# Altium schematic sheet MGT_PWR.SchDoc: {Наименование}
size 420 x 297 mm; DocumentNumber: ПЛАС.ХХХХХХ.ХХХ ХХ; SheetNumber: 2; SheetTotal: 11; PageSetup: Record=PageOptions|CenterHorizontal=False|CenterVertical=False|PrintScale=0.95|XCorrection=0.00|YCorrection=0.00|PrintKind=1|BorderSize=5000000|LeftOffset=0|BottomOffset=0|Orientation=1|PaperLength=1000|PaperWidth=1000|Scale=100|PaperSource=15|PrintQuality=600|MediaType=1|DitherType=10|PaperKind=A4|PrintScaleMode=1; Rule: PcbType=ProtelPcb
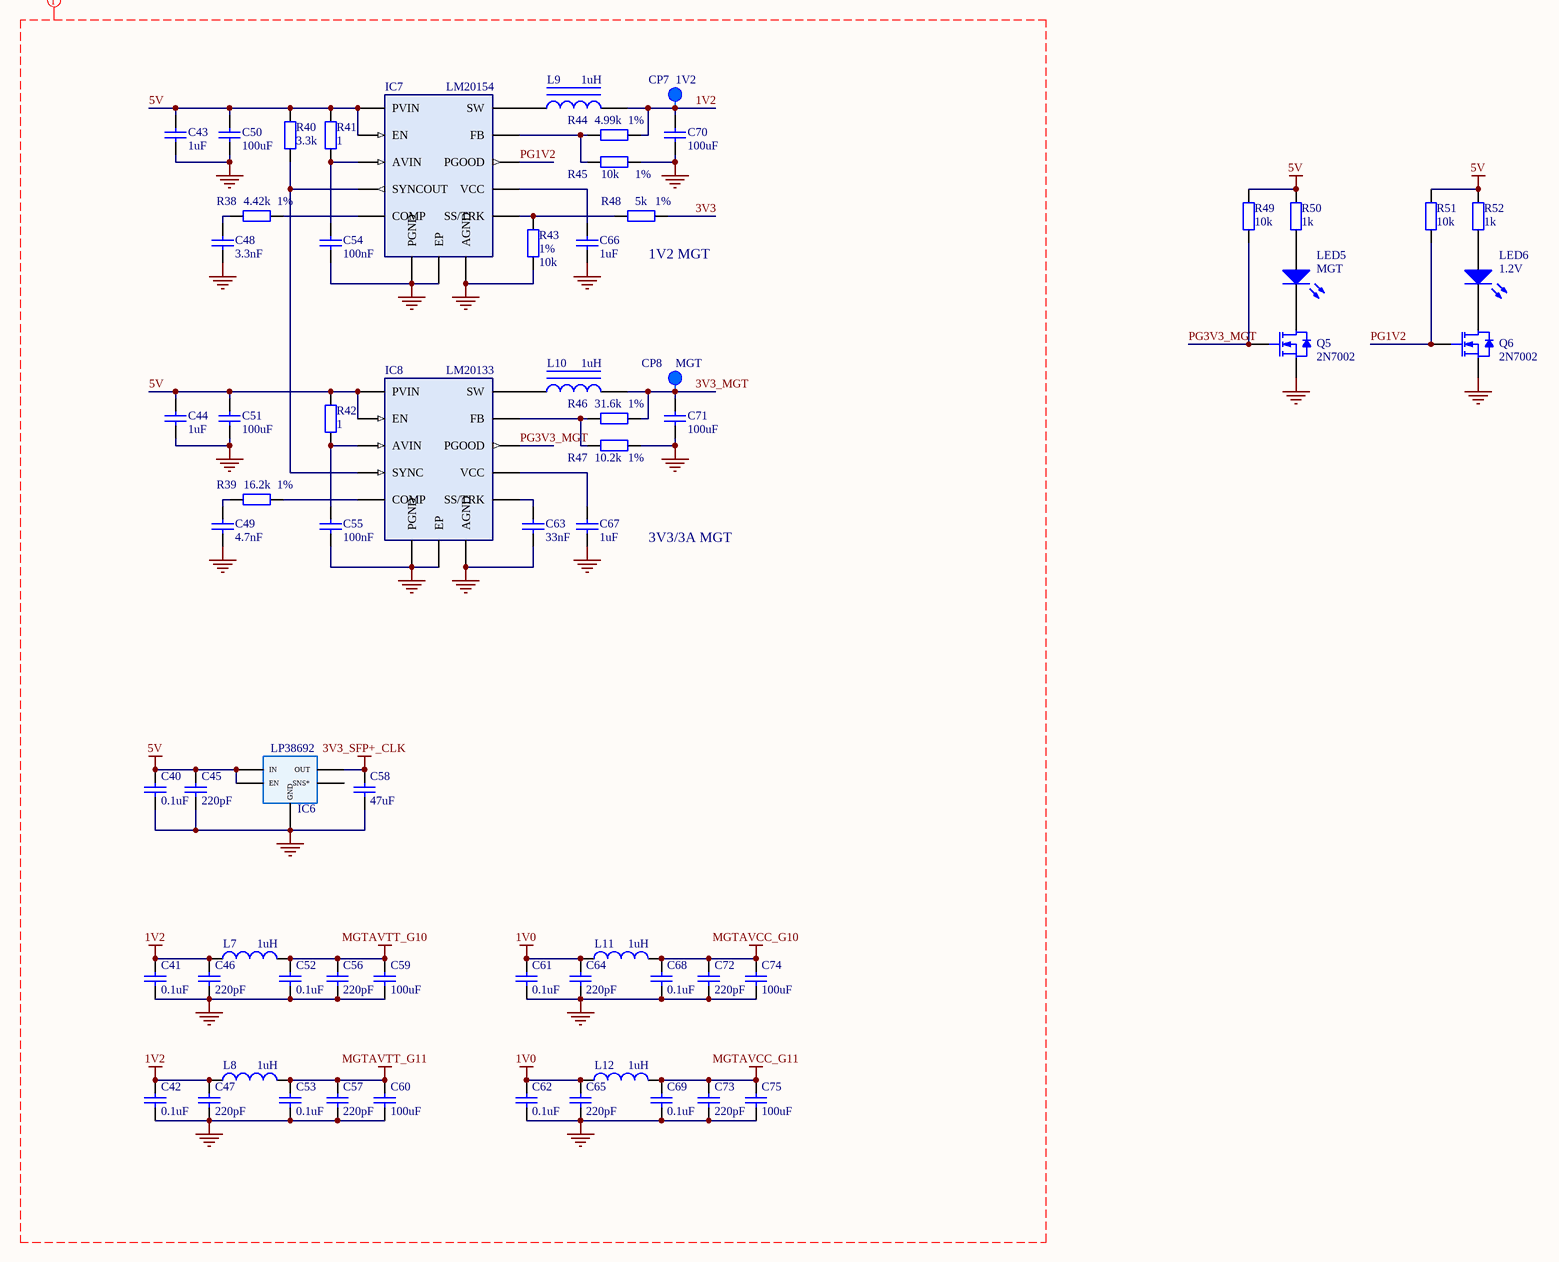
[diagram p0: MGT_PWR.SchDoc]

## Parts
C40  value 0.1uF  [C0603]  (hidden comment: Cap)
C41  value 0.1uF  [C0603]  (hidden comment: Cap)
C42  value 0.1uF  [C0603]  (hidden comment: Cap)
C43  value 1uF  [C0805]  (hidden comment: Cap)
C44  value 1uF  [C0805]  (hidden comment: Cap)
C45  value 220pF  [C0603]  (hidden comment: Cap)
C46  value 220pF  [C0603]  (hidden comment: Cap)
C47  value 220pF  [C0603]  (hidden comment: Cap)
C48  value 3.3nF  [C0603]  (hidden comment: Cap)
C49  value 4.7nF  [C0603]  (hidden comment: Cap)
C50  value 100uF  [C1210]  (hidden comment: Cap)
C51  value 100uF  [C1210]  (hidden comment: Cap)
C52  value 0.1uF  [C0603]  (hidden comment: Cap)
C53  value 0.1uF  [C0603]  (hidden comment: Cap)
C54  value 100nF  [C0603]  (hidden comment: Cap)
C55  value 100nF  [C0603]  (hidden comment: Cap)
C56  value 220pF  [C0603]  (hidden comment: Cap)
C57  value 220pF  [C0603]  (hidden comment: Cap)
C58  value 47uF  [C1210]  (hidden comment: Cap)
C59  value 100uF  [C1210]  (hidden comment: Cap)
C60  value 100uF  [C1210]  (hidden comment: Cap)
C61  value 0.1uF  [C0603]  (hidden comment: Cap)
C62  value 0.1uF  [C0603]  (hidden comment: Cap)
C63  value 33nF  [C0603]  (hidden comment: Cap)
C64  value 220pF  [C0603]  (hidden comment: Cap)
C65  value 220pF  [C0603]  (hidden comment: Cap)
C66  value 1uF  [C0603]  (hidden comment: Cap)
C67  value 1uF  [C0603]  (hidden comment: Cap)
C68  value 0.1uF  [C0603]  (hidden comment: Cap)
C69  value 0.1uF  [C0603]  (hidden comment: Cap)
C70  value 100uF  [C1210]  (hidden comment: Cap)
C71  value 100uF  [C1210]  (hidden comment: Cap)
C72  value 220pF  [C0603]  (hidden comment: Cap)
C73  value 220pF  [C0603]  (hidden comment: Cap)
C74  value 100uF  [C1210]  (hidden comment: Cap)
C75  value 100uF  [C1210]  (hidden comment: Cap)
CP7  1V2  [Control Point]
CP8  MGT  [Control Point]
IC6  LP38692  [SOT-223-5]
IC7  LM20154  [LM201xx]
IC8  LM20133  [LM201xx]
L7  value 1uH  [L1210_Murata LQH]  (hidden comment: Inductor_LF)
L8  value 1uH  [L1210_Murata LQH]  (hidden comment: Inductor_LF)
L9  value 1uH  [Coilcraft MSS1038]  (hidden comment: Inductor Power)
L10  value 1uH  [Coilcraft MSS1038]  (hidden comment: Inductor Power)
L11  value 1uH  [L1210_Murata LQH]  (hidden comment: Inductor_LF)
L12  value 1uH  [L1210_Murata LQH]  (hidden comment: Inductor_LF)
LED5  MGT  [LED_0402_Blue]
LED6  1.2V  [LED_0402_Blue]
Q5  2N7002  [SOT-23]
Q6  2N7002  [SOT-23]
R38  value 4.42k  Tolerance: 1%  [R0603]  (hidden comment: Res)
R39  value 16.2k  Tolerance: 1%  [R0603]  (hidden comment: Res)
R40  value 3.3k  [R0603]  (hidden comment: Res)
R41  value 1  [R0603]  (hidden comment: Res)
R42  value 1  [R0603]  (hidden comment: Res)
R43  value 10k  Tolerance: 1%  [R0603]  (hidden comment: Res)
R44  value 4.99k  Tolerance: 1%  [R0603]  (hidden comment: Res)
R45  value 10k  Tolerance: 1%  [R0603]  (hidden comment: Res)
R46  value 31.6k  Tolerance: 1%  [R0603]  (hidden comment: Res)
R47  value 10.2k  Tolerance: 1%  [R0603]  (hidden comment: Res)
R48  value 5k  Tolerance: 1%  [R0603]  (hidden comment: Res)
R49  value 10k  [R0402]  (hidden comment: Res)
R50  value 1k  [R0402]  (hidden comment: Res)
R51  value 10k  [R0402]  (hidden comment: Res)
R52  value 1k  [R0402]  (hidden comment: Res)

## Nets
1V0: C61.2 C62.2 C64.2 C65.1 L11.2 L12.2
1V2: C41.1 C42.1 C46.1 C47.1 C70.2 CP7.1 L7.2 L8.2 L9.2 R44.1
3V3_SFP+_CLK: C58.1 IC6.3(OUT)
5V: C40.1 C43.1 C44.1 C45.1 C50.1 C51.1 IC6.1(EN) IC6.4(IN) IC7.6(PVIN) IC7.12(EN) IC8.6(PVIN) IC8.12(EN) R40.2 R41.1 R42.2 R49.2 R50.2 R51.2 R52.2
GND: C40.2 C41.2 C42.2 C43.2 C44.2 C45.2 C46.2 C47.2 C48.1 C49.1 C50.2 C51.2 C52.2 C53.2 C54.2 C55.2 C56.2 C57.2 C58.2 C59.2 C60.2 C61.1 C62.1 C63.2 C64.1 C65.2 C66.2 C67.1 C68.2 C69.2 C70.1 C71.1 C72.2 C73.2 C74.2 C75.2 IC6.5(GND) IC7.10(PGND) IC7.15(AGND) IC7.17(EP) IC8.10(PGND) IC8.15(AGND) IC8.17(EP) Q5.2(S) Q6.2(S) R43.2 R45.2 R47.2
MGTAVCC_G10: C68.1 C72.1 C74.1 L11.1
MGTAVCC_G11: C69.1 C73.1 C75.1 L12.1
MGTAVTT_G10: C52.1 C56.1 C59.1 L7.1
MGTAVTT_G11: C53.1 C57.1 C60.1 L8.1
3V3: R48.1
3V3_MGT: C71.2 CP8.1 L10.2 R46.1
PG1V2: IC7.3(PGOOD) Q6.1(G) R51.1
PG3V3_MGT: IC8.3(PGOOD) Q5.1(G) R49.1
NetC48_2: C48.2 R38.1
NetC49_2: C49.2 R39.2
NetC54_1: C54.1 IC7.14(AVIN) R41.2
NetC55_1: C55.1 IC8.14(AVIN) R42.1
NetC63_1: C63.1 IC8.1(SS/TRK)
NetC66_1: C66.1 IC7.13(VCC)
NetC67_2: C67.2 IC8.13(VCC)
NetIC7_1: IC7.1(SS/TRK) R43.1 R48.2
NetIC7_2: IC7.2(FB) R44.2 R45.1
NetIC7_4: IC7.4(COMP) R38.2
NetIC7_8: IC7.8(SW) L9.1
NetIC7_16: IC7.16(SYNCOUT) IC8.16(SYNC) R40.1
NetIC8_2: IC8.2(FB) R46.2 R47.1
NetIC8_4: IC8.4(COMP) R39.1
NetIC8_8: IC8.8(SW) L10.1
NetLED5_1: LED5.1(K) Q5.3(D)
NetLED5_2: LED5.2(A) R50.1
NetLED6_1: LED6.1(K) Q6.3(D)
NetLED6_2: LED6.2(A) R52.1

Not connected (* = marked no-connect by the designer): IC6 6(SNS*)

## Layout directives
net class Power: 1V0, 1V2, 3V3, 3V3_MGT, 3V3_SFP+_CLK, 5V, GND, MGTAVCC_G10, MGTAVCC_G11, MGTAVTT_G10, MGTAVTT_G11, PG1V2, PG3V3_MGT

## Notes on the sheet
- (near R48) 1V2 MGT
- 3V3/3A MGT
- Подп. и дата
- Инв. № дубл.
- Взам. инв. №
- Инв. № подл.
- Лист
- Изм.
- № докум.
- Подп.
- Дата
- Копировал
- Формат А3

## Library data of the parts
C40-C47 C52 C53 C56 C57 C61 C62 C64 C65 C68 C69 C72 C73 = Cer Cap: Cer Cap Small; Manufacturer: Murata; Material: x5r; Voltage: 16V; Tolerance: 10%; Type: Ceramic; PackageReference: SMD Chip Capacitor
  C40-C42 C45-C47 C52 C53 C56 C57 C61 C62 C64 C65 C68 C69 C72 C73: Package: 0603
  C43 C44: Package: 0805
C48 C49 = Cer Cap: Cer Cap Small; Manufacturer: Murata; Material: x5r; Voltage: 25V; Tolerance: 10%; Type: Ceramic; PackageReference: SMD Chip Capacitor; Package: 0603
C50 C51 C58-C60 C70 C71 C74 C75 = Cap uF: Cer Cap Large; Manufacturer: Murata; Material: x5r; Tolerance: 20%; Voltage: 6.3V; Type: Ceramic; Package: C1210; PackageDescription: SMD Chip Capacitor
C54 C55 = Cer Cap: Cer Cap Small; Manufacturer: Murata; Material: x7r; Voltage: 16V; Tolerance: 10%; Type: Ceramic; PackageReference: SMD Chip Capacitor; Package: 0603
C63 = Cer Cap: Cer Cap Small; Manufacturer: Murata; Material: x7r; Voltage: 25V; Tolerance: 10%; Type: Ceramic; PackageReference: SMD Chip Capacitor; Package: 0603
C66 C67 = Cer Cap: Cer Cap Small; Manufacturer: Murata; Material: x5r; Voltage: 6.3V; Tolerance: 10%; Type: Ceramic; PackageReference: SMD Chip Capacitor; Package: 0603
CP7 CP8 = Control Point: Name: Control Point
IC6 = LP38692: Linear Regulator; Name: LP28692MP-3.3; Input Voltage: 2.7 V to 10 V; Output Accuracy: 2.5%; Dropout Voltage: 450 mV at 1 A; Package: SOT-223-5; Type: Linear Regulator; Temperature Range: –40°C to 125°C
IC7 = LM20154: Synchrous Buck Regulator; Current: 4A; Frequency: 1MHz; Input Voltage: 2.95V to 5.5V; Type: Synchrous Buck Regulator; Temperature Range: −40°C to + 125°C; Name: LM20154; Package: HTSSOP
IC8 = LM20133: Synchronous Buck Regulator; Input Voltage: 2.95V to 5.5V; Frequency: 500 kHz to 1.5 MHz; Current: 3A; Temperature Range: −40°C to + 125°C; Type: Synchronous Buck Regulator; Name: LM20133; Package: HTSSOP
L7 L8 L11 L12 = Inductor_LF: Inductor_Power_Lines; Manufacturer: Murata; Name: LQH32PN1R0NNC; Tolerance: 5%; Current: 2500mA; Frequency: 100MHz; Package: 1210; PackageDescription: Chip Inductor; Temperature Range: -25…85; Series: LQH
L9 L10 = Inductor Power: Magnetic-Core Inductor; Manufacturer: Coilcraft; Tolerance: ±30%; Name: MSS1038; Current: 5A; Package: Chip Inductor; Temperature Range: -40ºC to 125ºC
LED5 LED6 = LED: Typical RED, GREEN, YELLOW, AMBER GaAs LED; Manufacturer: Kingbright; Color: Blue; P/N: APHHS1005QBC/D; Package: 0402; Name: LED
Q5 Q6 = 2N7002: N-Channel MOSFET 2N7002; Current: 300mA; Voltage: 60V; Channel Resistance: 5Ohm; Power Dissipation: 0.83W; Name: 2N7002; Type: N-Channel MOSFET; Package: SOT-23
R38 R39 R43-R48 = Res: Resistor; Name: Chip SMD Resistor; Power: 0.062 Wt; Package: 0603; Temperature Range: -55…155
R40-R42 R49-R52 = Res: Resistor; Name: Chip SMD Resistor; Tolerance: 5%; Power: 0.062 Wt; Temperature Range: -55…155
  R40-R42: Package: 0603
  R49-R52: Package: 0402